# Altium schematic sheet Mako DSP Power R2.1.SchDoc
size A
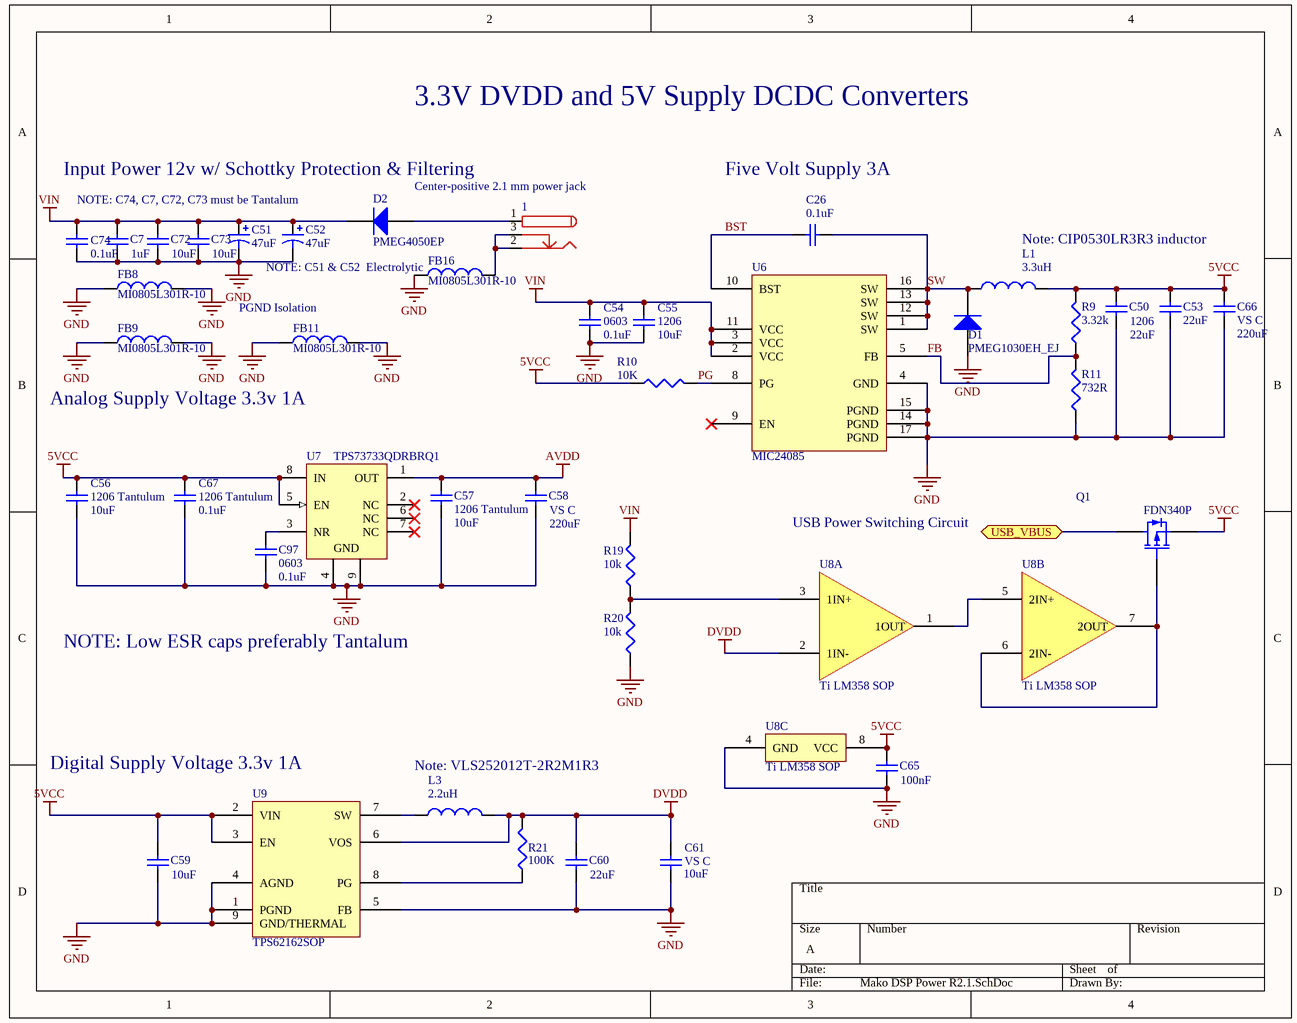
[diagram p0: Mako DSP Power R2.1.SchDoc]

## Parts
1  Center-positive 2.1 mm power jack  [PJ-102AH]
C7  value 1uF  [C1206]  (hidden comment: Cap Semi)
C26  value 0.1uF  [1608[0603]]  (hidden comment: Cap Semi)
C50  1206  value 22uF  [C1206]
C51  value 47uF  [CAPPR2.5-6.3x5]  (hidden comment: Cap Pol1)
C52  value 47uF  [CAPPR2.5-6.3x5]  (hidden comment: Cap Pol1)
C53  value 22uF  [C1206]  (hidden comment: Cap Semi)
C54  0603  value 0.1uF  [1608[0603]]
C55  1206  value 10uF  [C1206]
C56  1206 Tantulum  value 10uF  [C1206]
C57  1206 Tantulum  value 10uF  [C1206]
C58  VS C  value 220uF  [Panasonic VS C]
C59  value 10uF  [C1206]  (hidden comment: Cap Semi)
C60  value 22uF  [C1206]  (hidden comment: Cap Semi)
C61  VS C  value 10uF  [Panasonic VS C]
C65  value 100nF  [1608[0603]]  (hidden comment: Cap Semi)
C66  VS C  value 220uF  [Panasonic VS C]
C67  1206 Tantulum  value 0.1uF  [C1206]
C72  value 10uF  [C1206]  (hidden comment: Cap Semi)
C73  value 10uF  [C1206]  (hidden comment: Cap Semi)
C74  value 0.1uF  [C1206]  (hidden comment: Cap Semi)
C97  0603  value 0.1uF  [1608[0603]]
D1  PMEG1030EH_EJ  [PMEG1030EH_EJ]
D2  PMEG4050EP  [PMEG4050EP]
FB8  MI0805L301R-10  [SM 0805 - gap trimmed]
FB9  MI0805L301R-10  [SM 0805 - gap trimmed]
FB11  MI0805L301R-10  [SM 0805 - gap trimmed]
FB16  MI0805L301R-10  [SM 0805 - gap trimmed]
L1  value 3.3uH  [CIP0530LR3R3]  (hidden comment: Inductor)
L3  value 2.2uH  [VLS252012T-2R2M1R3]  (hidden comment: Inductor)
Q1  FDN340P  [SOT23-3N]
R9  value 3.32k  [J1-0603]  (hidden comment: Res3)
R10  value 10K  [J1-0603]  (hidden comment: Res3)
R11  value 732R  [J1-0603]  (hidden comment: Res3)
R19  value 10k  [J1-0603]  (hidden comment: Res3)
R20  value 10k  [J1-0603]  (hidden comment: Res3)
R21  value 100K  [RESC2012L]  (hidden comment: Res3)
U6  MIC24085  [MIC24085-AYML]
U7  TPS73733QDRBRQ1  [TI-DRB8-1750X1500TP_V]
U8  Ti LM358 SOP  [LM358]  (parts A,B,C of 3)
U9  TPS62162SOP  [TPS62162SOP]

## Ports
USB_VBUS (bidir)

## Nets
5VCC: C50.2 C53.1 C56.1 C59.2 C65.1 C66.2 C67.2 L1.2 Q1.2(D) R9.2 R10.1 U7.5(EN) U7.8(IN) U8.8(VCC) U9.2(VIN) U9.3(EN)
AVDD: C57.1 C58.1 U7.1(OUT)
DVDD: C60.2 C61.1 L3.2 R21.2 U8.2(1IN-) U9.6(VOS)
GND: C7.1 C50.1 C51.2 C52.2 C53.2 C54.1 C55.1 C56.2 C57.2 C58.2 C59.1 C60.1 C61.2 C65.2 C66.1 C67.1 C72.1 C73.1 C74.1 C97.1 D1.1(A) FB8.1 FB8.2 FB9.1 FB9.2 FB11.1 FB11.2 FB16.1 R11.1 R20.1 U6.4(GND) U6.14(PGND) U6.15(PGND) U6.17(PGND) U7.4(GND) U7.9(GND) U8.4(GND) U9.1(PGND) U9.4(AGND) U9.5(FB) U9.9(GND/THERMAL)
VIN: C7.2 C51.1 C52.1 C54.2 C55.2 C72.2 C73.2 C74.2 D2.1(A) R19.2 U6.2(VCC) U6.3(VCC) U6.11(VCC)
BST: C26.2 U6.10(BST)
FB: R9.1 R11.2 U6.5(FB)
PG: R10.2 U6.8(PG)
SW: C26.1 D1.2(K) L1.1 U6.1(SW) U6.12(SW) U6.13(SW) U6.16(SW)
USB_VBUS: Q1.3(S) ; port USB_VBUS
Net1_1: 1.1 D2.2(K)
Net1_2: 1.2 1.3 FB16.2
NetC97_2: C97.2 U7.3(NR)
NetL3_1: L3.1 U9.7(SW)
NetQ1_1: Q1.1(G) U8.6(2IN-) U8.7(2OUT)
NetR19_1: R19.1 R20.2 U8.3(1IN+)
NetR21_1: R21.1 U9.8(PG)
NetU8_1: U8.1(1OUT) U8.5(2IN+)

Not connected (* = marked no-connect by the designer): U6 6(NC) 7(NC) 9(EN)*; U7 2(NC)* 6(NC)* 7(NC)*

## Notes on the sheet
- 3.3V DVDD and 5V Supply DCDC Converters
- Input Power 12v w/ Schottky Protection & Filtering
- NOTE: C74, C7, C72, C73 must be Tantalum
- Five Volt Supply 3A
- (near FB16) NOTE: C51 & C52  Electrolytic
- Note: CIP0530LR3R3 inductor
- (near FB11) PGND Isolation
- Analog Supply Voltage 3.3v 1A
- USB Power Switching Circuit
- NOTE: Low ESR caps preferably Tantalum
- (near U9) Digital Supply Voltage 3.3v 1A
- Note: VLS252012T-2R2M1R3

## Library data of the parts
1 = PWR2.5: Power jack; Published: 17-Dec-2003; DatasheetDocument: 09-May-2002; Publisher: Altium Limited; ComponentLink1Description: Manufacturer Link; ComponentLink1URL: http://domino.kycon.com/internet/Products.html
C7 C26 C50 C53-C61 C65-C67 C72-C74 C97 = Cap Semi: Capacitor (Semiconductor SIM Model); Published: 8-Jun-2000; LatestRevisionDate: 29-May-2009; LatestRevisionNote: IPC-7351 Footprint Added.; PackageReference: C1206; Publisher: Altium Limited; PackageDescription: Chip Capacitor
C51 C52 = Cap Pol1: Polarized Capacitor (Radial); Published: 8-Jun-2000; LatestRevisionDate: 17-Jul-2002; LatestRevisionNote: Re-released for DXP Platform.; PackageReference: RB7.6-15; Publisher: Altium Limited; PackageDescription: Polarized Capacitor (Radial); 2 Leads
D1 D2 = Diode: Default Diode; Published: 8-Jun-2000; LatestRevisionDate: 17-Jul-2002; LatestRevisionNote: Re-released for DXP Platform.; PackageVersion: Sep-1996; PackageReference: SMC; Publisher: Altium Limited; PackageDescription: DO-214-AB/SMC; 2 C-Bend Leads; Body 7.9 x 5.9 mm, inc. leads (LxW); Code_JEDEC: DO-214-AB
FB8 FB9 FB11 FB16 L1 L3 = Inductor: Code_IEC: 1005; Published: 8-Jun-2000; PackageReference: 0402-A; Publisher: Altium Limited; Code_JEITA: 0402
  FB8 FB9 FB11 FB16: LatestRevisionDate: 17-Jul-2002; LatestRevisionNote: Re-released for DXP Platform.
  L1 L3: LatestRevisionDate: 29-May-2009; LatestRevisionNote: IPC-7351 Footprint Added.; PackageDescription: Chip Inductor
Q1 = FDN340P: P-Channel MOSFET; Published: 8-Jun-2000; LatestRevisionDate: 17-Jul-2002; LatestRevisionNote: Re-released for DXP Platform.; PackageVersion: 1995/1996; PackageReference: E3; Publisher: Altium Limited; PackageDescription: TO, Flat Index; 3 In-Line, Axial Leads; Body Dia. 4.6mm; Lead Dia. 0.5 mm (max)
R9-R11 R19-R21 = Res3: Resistor; Published: 8-Jun-2000; LatestRevisionDate: 29-May-2009; LatestRevisionNote: IPC-7351 Footprint Added.; PackageReference: J1-0603; Publisher: Altium Limited; PackageDescription: Chip Resistor
U7 = TPS73733QDRBRQ1: Single Output Automotive LDO, 1 A, Fixed 3.3 V Output, 2.2 to 5.5 V Input, with Reverse Current Protection, 8-pin SON (DRB), -40 to 125 degC, Green (RoHS & no Sb/Br); Manufacturer: Texas Instruments; Accuracy(%): 3; Fixed Output Options(V): 3.3; Iout(Max)(A): 1; Iq(Typ)(mA): 0.3; SubFamily: Single Channel LDO; Vdo(Typ)(mV): 130; Vin(Max)(V): 5.5; Vin(Min)(V): 2.2; DatasheetVersion: SBVS123; PackageVersion: 4203482-2/K; PackageReference: DRB8-1750X1500TP; PackageDescription: 8-Pin Plastic Small Outline, Body 3 x 3 mm, Pitch 0.65 mm; Supplier 1: Digi-Key; Supplier Part Number 1: 296-24157-2-ND; Supplier 2: Digi-Key; Supplier Part Number 2: 296-24157-1-ND; Supplier 3: Digi-Key; Supplier Part Number 3: 296-24157-6-ND; Supplier 4: Newark; Supplier Part Number 4: 56P3118; Supplier 5: Mouser; Supplier Part Number 5: 595-TPS73733QDRBRQ1; Eco-Plan: Green (RoHS & no Sb/Br); Rating: Automotive; Vout Adj(Max)(V): 3.3; Vout Adj(Min)(V): 3.3; Mounting Technology: Surface Mount; PartNumber: TPS73733QDRBRQ1; ComponentLink1Description: Manufacturer URL; ComponentLink1URL: http://www.ti.com/; ComponentLink2Description: Datasheet; ComponentLink2URL: http://www.ti.com/general/docs/lit/getliterature.tsp?genericPartNumber=TPS73733-Q1&fileType=pdf; ComponentLink3Description: Package Specification; ComponentLink3URL: http://www.ti.com/litv/pdf/mpds118h
U8 = LM358_Symbol